# Altium schematic sheet SOURCE.SchDoc
size A4; SheetNumber: 4; SheetTotal: 5
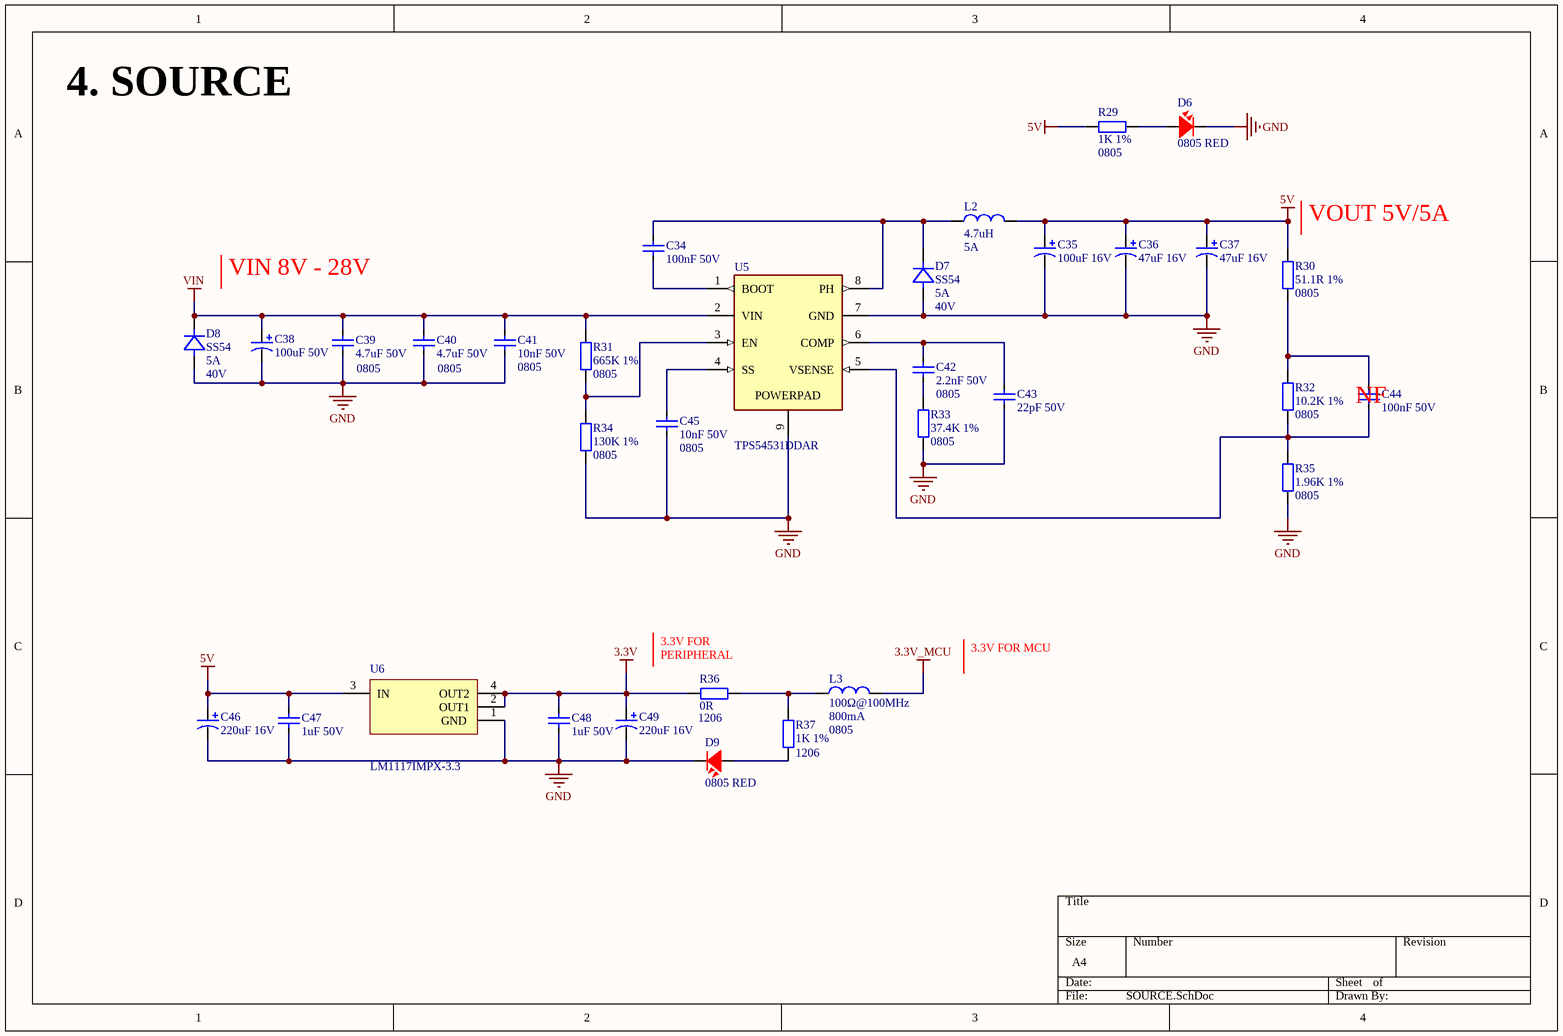
[diagram p0: SOURCE.SchDoc]

## Parts
C34  100nF 50V  [CAP_SMD_0805]
C35  100uF 16V  [CAP-ALU-SMD-D]
C36  47uF 16V  [CAP-ALU-SMD-C]
C37  47uF 16V  [CAP-ALU-SMD-C]
C38  100uF 50V  [CAP-ALU-SMD-F]
C39  4.7uF 50V  Size: 0805  [CAP_SMD_0805]
C40  4.7uF 50V  Size: 0805  [CAP_SMD_0805]
C41  10nF 50V  Size: 0805  [CAP_SMD_0805]
C42  2.2nF 50V  Size: 0805  [CAP_SMD_0805]
C43  22pF 50V  [CAP_SMD_0805]
C44  100nF 50V  [CAP_SMD_0805]
C45  10nF 50V  Size: 0805  [CAP_SMD_0805]
C46  220uF 16V  [CAP-ALU-SMD-D]
C47  1uF 50V  [CAP_SMD_0805]
C48  1uF 50V  [CAP_SMD_0805]
C49  220uF 16V  [CAP-ALU-SMD-D]
D6  0805 RED  [LED-0805-Red]
D7  SS54  Current: 5A  DC Voltage: 40V  [SMA]
D8  SS54  Current: 5A  DC Voltage: 40V  [SMA]
D9  0805 RED  [LED-0805-Red]
L2  Inductor: 4.7uH  Current: 5A  [L0630]  (hidden comment: 4.7uH 5A)
L3  Impedance @ Frequency: 100Ω@100MHz  Current: 800mA  Size: 0805  [FB_0805]  (hidden comment: 100Ohms 100Mhz)
R29  1K 1%  Size: 0805  [RES_SMD_0805]
R30  51.1R 1%  Size: 0805  [RES_SMD_0805]
R31  665K 1%  Size: 0805  [RES_SMD_0805]
R32  10.2K 1%  Size: 0805  [RES_SMD_0805]
R33  37.4K 1%  Size: 0805  [RES_SMD_0805]
R34  130K 1%  Size: 0805  [RES_SMD_0805]
R35  1.96K 1%  Size: 0805  [RES_SMD_0805]
R36  0R  Size: 1206  [RES_SMD_1206]
R37  1K 1%  Size: 1206  [RES_SMD_1206]
U5  TPS54531DDAR  [TPS54531DDAR]
U6  LM1117IMPX-3.3  [SOT-223-4]

## Nets
3.3V: C48.2 C49.1 R36.1 U6.2(OUT1) U6.4(OUT2)
3.3V_MCU: L3.2
5V: C35.1 C36.1 C37.1 C46.1 C47.2 L2.2 R29.1 R30.2 U6.3(IN)
GND: C35.2 C36.2 C37.2 C38.2 C39.1 C40.1 C41.1 C43.1 C45.1 C46.2 C47.1 C48.1 C49.2 D6.2 D7.A D8.A D9.2 R33.1 R34.1 R35.1 U5.7(GND) U5.9(POWERPAD) U6.1(GND)
VIN: C38.1 C39.2 C40.2 C41.2 D8.C R31.2 U5.2(VIN)
NetC34_1: C34.1 U5.1(BOOT)
NetC34_2: C34.2 D7.C L2.1 U5.8(PH)
NetC42_1: C42.1 R33.2
NetC42_2: C42.2 C43.2 U5.6(COMP)
NetC44_1: C44.1 R32.1 R35.2 U5.5(VSENSE)
NetC44_2: C44.2 R30.1 R32.2
NetC45_2: C45.2 U5.4(SS)
NetD6_1: D6.1 R29.2
NetD9_1: D9.1 R37.1
NetL3_1: L3.1 R36.2 R37.2
NetR31_1: R31.1 R34.2 U5.3(EN)

## Notes on the sheet
- 4. SOURCE
- (near R30) VOUT 5V/5A
- VIN 8V - 28V
- (near C44) NF
- (near R36) 3.3V FOR PERIPHERAL
- 3.3V FOR MCU
- (in symbol LM1117IMPX-3.3/NOPB) /

## Library data of the parts
C34 C44 = C0805_MLCC_100nF_50V: 0.1 µF ±10% 50V Ceramic Capacitor X7R 0805 (2012 Metric); Manufacturer: YAGEO; Manufacture Part Number: CC0805KRX7R9BB104; Packaging: Cut Tape (CT); Link: https://www.digikey.cn/en/products/detail/yageo/CC0805KRX7R9BB104/302874; Price: $0.10; Size: 0805
C35 = C_ALU_100uF_16V: 100uF 16V 63mA@120Hz ±20% SMD,D6.3xL5.4mm Aluminum Electrolytic Capacitors - SMD ROHS; Manufacturer: DMBJ; Manufacture Part Number: RVT1C101M0605 100UF 16V; Link: https://www.lcsc.com/product-detail/Aluminum-Electrolytic-Capacitors-SMD_DMBJ-RVT1C101M0605-100UF-16V_C970684.html; Price: $1.37
C36 C37 = C_ALU_47uF_16V: 47uF 16V 33mA@120Hz ±20% SMD,D5xL5.4mm Aluminum Electrolytic Capacitors - SMD ROHS; Manufacturer: DMBJ; Manufacture Part Number: RVT1C470M0505 47UF 16V; Link: https://www.lcsc.com/product-detail/Aluminum-Electrolytic-Capacitors-SMD_DMBJ-RVT1C470M0505-47UF-16V_C970676.html; Price: $ 0.0316
C38 = C_ALU_100uF_50V: 100uF 50V 140mA@120Hz ±20% SMD,D8xL10mm Aluminum Electrolytic Capacitors - SMD ROHS; Manufacturer: Nichicon; Manufacture Part Number: UWT1H101MNL1GS; Link: https://jlcpcb.com/partdetail/Nichicon-UWT1H101MNL1GS/C445063?spm=searchList; Price: $0.1311
C39 C40 = C0805_MLCC_4.7uF_50V: 4.7 µF ±10% 50V Ceramic Capacitor X5R 0805 (2012 Metric); Manufacturer: Samsung Electro-Mechanics; Manufacture Part Number: CL21A475KBQNNNE; Packaging: Cut Tape (CT); Link: https://www.digikey.cn/en/products/detail/samsung-electro-mechanics/CL21A475KBQNNNE/3886906; Price: $0.23
C41 C45 = C0805_MLCC_10nF_50V: 10000 pF ±10% 50V Ceramic Capacitor X7R 0805 (2012 Metric); Manufacturer: Samsung Electro-Mechanics; Manufacture Part Number: CL21B103KBANNNC; Packaging: Cut Tape (CT); Link: https://www.digikey.cn/en/products/detail/samsung-electro-mechanics/CL21B103KBANNNC/3886673; Price: $0.10
C42 = C0805_MLCC_2.2nF_50V: 2200 pF ±1% 50V Ceramic Capacitor C0G, NP0 0805 (2012 Metric); Manufacturer: YAGEO; Manufacture Part Number: CC0805FKNPO9BN222; Packaging: Cut Tape (CT); Link: https://www.digikey.cn/en/products/detail/yageo/CC0805FKNPO9BN222/5883918; Price: $0.45
C43 = C0805_MLCC_22pF_50V: 22 pF ±1% 250V Ceramic Capacitor C0G, NP0 0805 (2012 Metric); Manufacturer: KYOCERA AVX; Manufacture Part Number: 600F220FT250XT; Packaging: Cut Tape (CT); Link: https://www.digikey.cn/en/products/detail/kyocera-avx/600F220FT250XT/3905100; Price: $2.26; Size: 0805
C46 C49 = C_ALU_220uF_16V: 16V 220uF ±20% SMD,6.3x7.7mm Solid Capacitors ROHS; Manufacturer: Lelon; Manufacture Part Number: OVZ221M1CTR-0608ACS; Link: https://jlcpcb.com/partdetail/Lelon-OVZ221M1CTR0608ACS/C881921; Price: $0.1949
C47 C48 = C0805_MLCC_1uF_50V: 1 µF ±10% 50V Ceramic Capacitor X7R 0805 (2012 Metric); Manufacturer: Samsung Electro-Mechanics; Manufacture Part Number: CL21B105KBFNNNG; Packaging: Cut Tape (CT); Link: https://www.digikey.cn/en/products/detail/samsung-electro-mechanics/CL21B105KBFNNNG/3894467; Price: $0.11; Size: 0805
D6 D9 = LED_0805_RED: Red 625nm LED Indication - Discrete 2V 0805 (2012 Metric); Manufacturer: Würth Elektronik; Manufacture Part Number: 150080RS75000; Packaging: Cut Tape (CT); Link: https://www.digikey.cn/en/products/detail/w%C3%BCrth-elektronik/150080RS75000/4489918; Price: $0.19
D7 D8 = SS54: DIODE SCHOTTKY 40V 5A SMA; Manufacturer: EVVO; Manufacture Part Number: SS54; Packaging: Cut Tape (CT); Link: https://www.digikey.cn/en/products/detail/evvo/SS54/21407219; Price: $0.73
L2 = L0630_4.7uH _5A: 4.7 µH Shielded Molded Inductor 3.2 A 81.3mOhm Max Nonstandard; Manufacturer: SHOU HAN; Manufacture Part Number: CYA0630-4.7UH; Packaging: Cut Tape (CT); Link: https://www.lcsc.com/product-detail/Inductors-SMD_SHOU-HAN-CYA0630-4-7UH_C5189748.html; Price: $ 0.1112
L3 = FR_100Ohms_100Mhz: Manufacturer: TAI-TECH; Manufacture Part Number: FCM2012KF-101T08; Link: https://jlcpcb.com/partdetail/taitech-FCM2012KF101T08/C304250; Price: $0.0064
R29 = R0805_1K: 1 kOhms ±1% 0.125W, 1/8W Chip Resistor 0805 (2012 Metric) Moisture Resistant Thick Film; Manufacturer: YAGEO; Manufacture Part Number: 311-1.00KCRCT-ND; Packaging: Cut Tape (CT); Link: https://www.digikey.com/en/products/detail/yageo/RC0805FR-071KL/727444; Price: $0.10
R30 = R0805_51.1R: 51.1 Ohms ±1% 0.125W, 1/8W Chip Resistor 0805 (2012 Metric) Moisture Resistant Thick Film; Manufacturer: YAGEO; Manufacture Part Number: RC0805FR-0751R1L; Packaging: Cut Tape (CT); Link: https://www.digikey.cn/en/products/detail/yageo/RC0805FR-0751R1L/728014; Price: $0.10
R31 = R0805_665K: 665 kOhms ±1% 0.125W, 1/8W Chip Resistor 0805 (2012 Metric) Moisture Resistant Thick Film; Manufacturer: YAGEO; Manufacture Part Number: RC0805FR-07665KL; Packaging: Cut Tape (CT); Link: https://www.digikey.cn/en/products/detail/yageo/RC0805FR-07665KL/728096; Price: $0.10
R32 = R0805_10.2K: 10.2 kOhms ±1% 0.125W, 1/8W Chip Resistor 0805 (2012 Metric) Moisture Resistant Thick Film; Manufacturer: YAGEO; Manufacture Part Number: RC0805FR-0710K2L; Packaging: Cut Tape (CT); Link: https://www.digikey.cn/en/products/detail/yageo/RC0805FR-0710K2L/727538; Price: $0.10
R33 = R0805_37.4K: 37.4 kOhms ±1% 0.125W, 1/8W Chip Resistor 0805 (2012 Metric) Moisture Resistant Thick Film; Manufacturer: YAGEO; Manufacture Part Number: RC0805FR-0737K4L; Packaging: Cut Tape (CT); Link: https://www.digikey.cn/en/products/detail/yageo/RC0805FR-0737K4L/727891; Price: $0.10
R34 = R0805_130K: 130 kOhms ±1% 0.125W, 1/8W Chip Resistor 0805 (2012 Metric) Moisture Resistant Thick Film; Manufacturer: YAGEO; Manufacture Part Number: RC0805FR-07130KL; Packaging: Cut Tape (CT); Link: https://www.digikey.cn/en/products/detail/yageo/RC0805FR-07130KL/727590; Price: $0.10
R35 = R0805_1.96K: 1.96 kOhms ±1% 0.125W, 1/8W Chip Resistor 0805 (2012 Metric) Moisture Resistant Thick Film; Manufacturer: YAGEO; Manufacture Part Number: RC0805FR-071K96L; Packaging: Cut Tape (CT); Link: https://www.digikey.cn/en/products/detail/yageo/RC0805FR-071K96L/727532; Price: $0.10
R36 = R1206_0R: 0 Ohms Jumper Chip Resistor 1206 (3216 Metric) Moisture Resistant Thick Film; Manufacturer: YAGEO; Manufacture Part Number: RC1206JR-070RL; Packaging: Cut Tape (CT); Link: https://www.digikey.cn/en/products/detail/yageo/RC1206JR-070RL/729184; Price: $0.18
R37 = R1206_1K: 1 kOhms ±1% 0.5W, 1/2W Chip Resistor 1206 (3216 Metric) Anti-Sulfur Thin Film; Manufacturer: Stackpole Electronics Inc; Manufacture Part Number: RNCP1206FTD1K00; Packaging: Cut Tape (CT); Link: https://www.digikey.cn/en/products/detail/stackpole-electronics-inc/RNCP1206FTD1K00/2240337; Price: $0.18
U5 = TPS54531DDAR: Buck Switching Regulator IC Positive Adjustable 0.8V 1 Output 5A 8-PowerSOIC (0.154", 3.90mm Width); Manufacturer: Texas Instruments; Manufacture Part Number: TPS54531DDAR; Packaging: Cut Tape; Link: https://www.digikey.cn/en/products/detail/texas-instruments/TPS54531DDAR/4162425; Price: $1.79
U6 = LM1117IMPX-3.3/NOPB: Linear Voltage Regulator IC Positive Fixed 1 Output 800mA SOT-223-4; Manufacturer: Texas Instruments; Manufacture Part Number: LM1117IMPX-3.3/NOPB; Packaging: Cut Tape (CT); Link: https://www.digikey.cn/en/products/detail/texas-instruments/LM1117IMPX-3-3-NOPB/1870906; Price: $1.14